# Altium schematic sheet EC25.SchDoc
size C; SheetNumber: 4; SheetTotal: 10
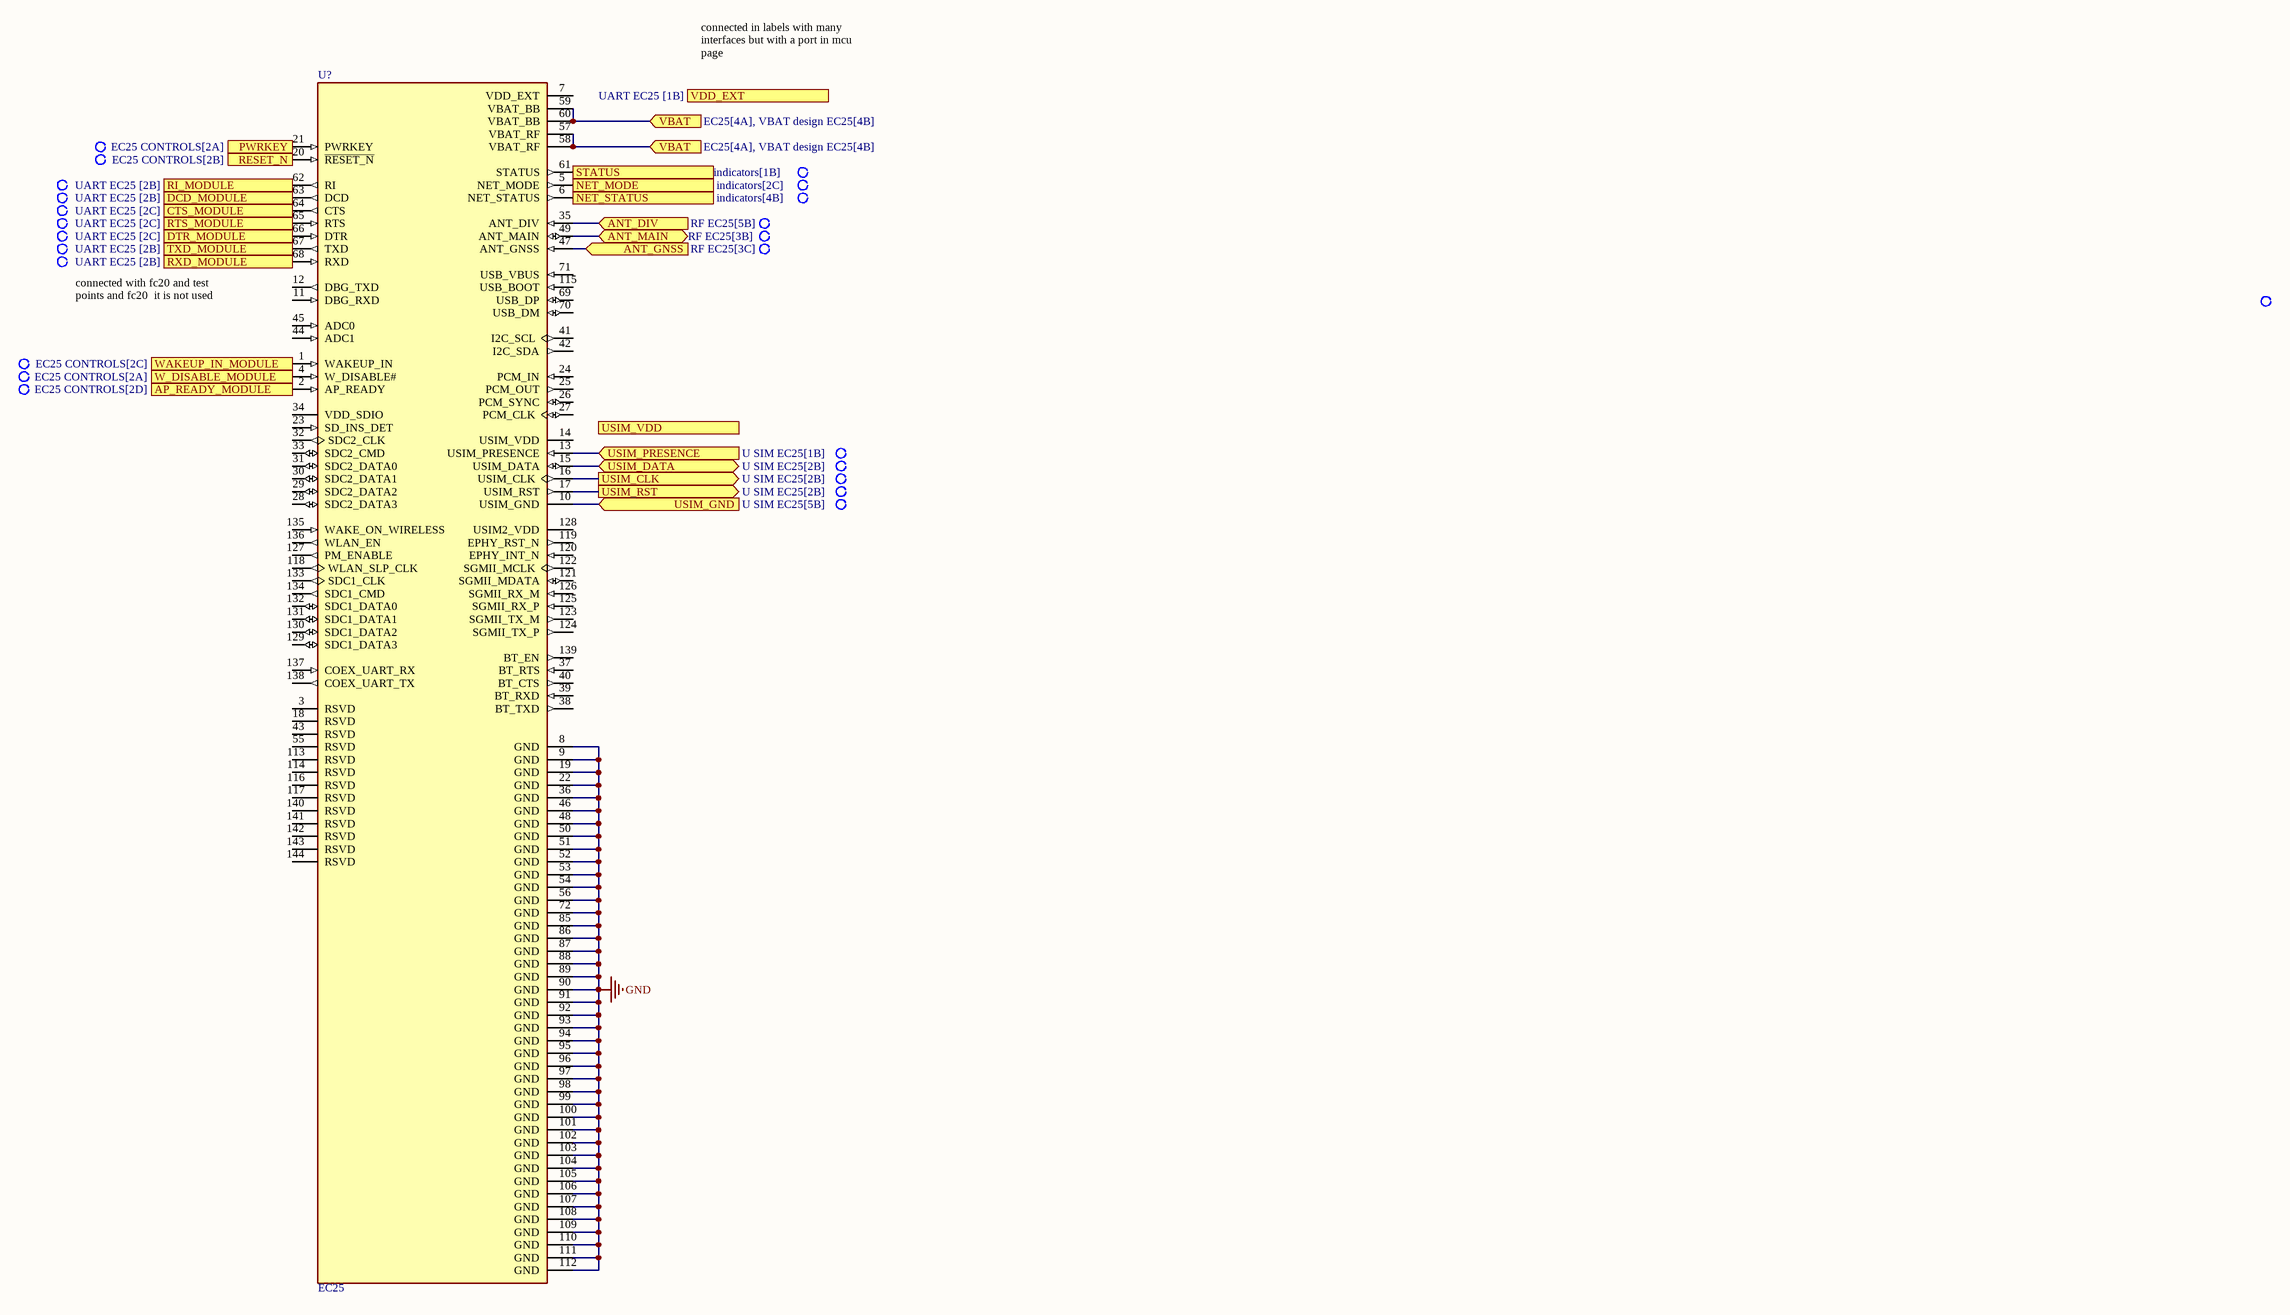
[diagram p0: EC25.SchDoc]

## Parts
U?  EC25  [XCVR_EC25]

## Ports
ANT_DIV (in, see RF EC25[5B]), ANT_GNSS (in, see RF EC25[3C]), ANT_MAIN (bidir, see RF EC25[3B]), AP_READY_MODULE (in, see EC25 CONTROLS[2D]), CTS_MODULE (out, see UART EC25 [2C]), DCD_MODULE (out, see UART EC25 [2B]), DTR_MODULE (in, see UART EC25 [2C]), NET_MODE (out, see indicators[2C]), NET_STATUS (out, see indicators[4B]), PWRKEY (in, see EC25 CONTROLS[2A]), RESET_N (in, see EC25 CONTROLS[2B]), RI_MODULE (out, see UART EC25 [2B]), RTS_MODULE (in, see UART EC25 [2C]), RXD_MODULE (in, see UART EC25 [2B]), STATUS (out, see indicators[1B]), TXD_MODULE (out, see UART EC25 [2B]), USIM_CLK (out, see U SIM EC25[2B]), USIM_DATA (bidir, see U SIM EC25[2B]), USIM_GND (in, see U SIM EC25[5B]), USIM_PRESENCE (in, see U SIM EC25[1B]), USIM_RST (out, see U SIM EC25[2B]), USIM_VDD (out), VBAT (in, see EC25[4A], VBAT design EC25[4B]), VDD_EXT (out, see UART EC25 [1B]), W_DISABLE_MODULE (in, see EC25 CONTROLS[2A]), WAKEUP_IN_MODULE (in, see EC25 CONTROLS[2C])

## Nets
GND: U?.8(GND) U?.9(GND) U?.19(GND) U?.22(GND) U?.36(GND) U?.46(GND) U?.48(GND) U?.50(GND) U?.51(GND) U?.52(GND) U?.53(GND) U?.54(GND) U?.56(GND) U?.72(GND) U?.85(GND) U?.86(GND) U?.87(GND) U?.88(GND) U?.89(GND) U?.90(GND) U?.91(GND) U?.92(GND) U?.93(GND) U?.94(GND) U?.95(GND) U?.96(GND) U?.97(GND) U?.98(GND) U?.99(GND) U?.100(GND) U?.101(GND) U?.102(GND) U?.103(GND) U?.104(GND) U?.105(GND) U?.106(GND) U?.107(GND) U?.108(GND) U?.109(GND) U?.110(GND) U?.111(GND) U?.112(GND)
ANT_DIV: U?.35(ANT_DIV) ; port ANT_DIV
ANT_GNSS: U?.47(ANT_GNSS) ; port ANT_GNSS
ANT_MAIN: U?.49(ANT_MAIN) ; port ANT_MAIN
AP_READY_MODULE: U?.2(AP_READY) ; port AP_READY_MODULE
CTS_MODULE: U?.64(CTS) ; port CTS_MODULE
DCD_MODULE: U?.63(DCD) ; port DCD_MODULE
DTR_MODULE: U?.66(DTR) ; port DTR_MODULE
NET_MODE: U?.5(NET_MODE) ; port NET_MODE
NET_STATUS: U?.6(NET_STATUS) ; port NET_STATUS
PWRKEY: U?.21(PWRKEY) ; port PWRKEY
RESET_N: U?.20(~{RESET_N}) ; port RESET_N
RI_MODULE: U?.62(RI) ; port RI_MODULE
RTS_MODULE: U?.65(RTS) ; port RTS_MODULE
RXD_MODULE: U?.68(RXD) ; port RXD_MODULE
STATUS: U?.61(STATUS) ; port STATUS
TXD_MODULE: U?.67(TXD) ; port TXD_MODULE
USIM_CLK: U?.16(USIM_CLK) ; port USIM_CLK
USIM_DATA: U?.15(USIM_DATA) ; port USIM_DATA
USIM_GND: U?.10(USIM_GND) ; port USIM_GND
USIM_PRESENCE: U?.13(USIM_PRESENCE) ; port USIM_PRESENCE
USIM_RST: U?.17(USIM_RST) ; port USIM_RST
VBAT: U?.57(VBAT_RF) U?.58(VBAT_RF) U?.59(VBAT_BB) U?.60(VBAT_BB) ; port VBAT
W_DISABLE_MODULE: U?.4(W_DISABLE#) ; port W_DISABLE_MODULE
WAKEUP_IN_MODULE: U?.1(WAKEUP_IN) ; port WAKEUP_IN_MODULE

Not connected (* = marked no-connect by the designer): U? 3(RSVD) 7(VDD_EXT) 11(DBG_RXD) 12(DBG_TXD) 14(USIM_VDD) 18(RSVD) 23(SD_INS_DET) 24(PCM_IN) 25(PCM_OUT) 26(PCM_SYNC) 27(PCM_CLK) 28(SDC2_DATA3) 29(SDC2_DATA2) 30(SDC2_DATA1) 31(SDC2_DATA0) 32(SDC2_CLK) 33(SDC2_CMD) 34(VDD_SDIO) 37(BT_RTS) 38(BT_TXD) 39(BT_RXD) 40(BT_CTS) 41(I2C_SCL) 42(I2C_SDA) 43(RSVD) 44(ADC1) 45(ADC0) 55(RSVD) 69(USB_DP) 70(USB_DM) 71(USB_VBUS) 113(RSVD) 114(RSVD) 115(USB_BOOT) 116(RSVD) 117(RSVD) 118(WLAN_SLP_CLK) 119(EPHY_RST_N) 120(EPHY_INT_N) 121(SGMII_MDATA) 122(SGMII_MCLK) 123(SGMII_TX_M) 124(SGMII_TX_P) 125(SGMII_RX_P) 126(SGMII_RX_M) 127(PM_ENABLE) 128(USIM2_VDD) 129(SDC1_DATA3) 130(SDC1_DATA2) 131(SDC1_DATA1) 132(SDC1_DATA0) 133(SDC1_CLK) 134(SDC1_CMD) 135(WAKE_ON_WIRELESS) 136(WLAN_EN) 137(COEX_UART_RX) 138(COEX_UART_TX) 139(BT_EN) 140(RSVD) 141(RSVD) 142(RSVD) 143(RSVD) 144(RSVD)

## Notes on the sheet
- connected in labels with many interfaces but with a port in mcu page
- connected with fc20 and test points and fc20  it is not used

## Library data of the parts
U? = EC25: LTE Cat 4 module; 32.0mm 29.0mm 2.4mm; Max. 150Mbps downlink / 50Mbps uplink; LCC form factor; Extended temperature range of -40C to +85C.; MF: Quectel; Availability: In Stock; Check_prices: https://www.snapeda.com/parts/EC25/Quectel/view-part/?ref=eda; Package: Custom Quectel; SnapEDA_Link: https://www.snapeda.com/parts/EC25/Quectel/view-part/?ref=snap; MP: EC25; Price: None; Value: *